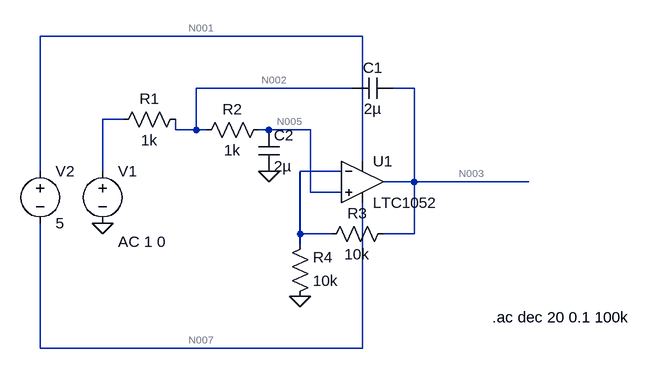
[diagram p0: schematic Draft4.asc]
Draft4.asc, the LTspice schematic file:
Version 4
SHEET 1 880 680
WIRE 240 -48 -256 -48
WIRE 224 32 -16 32
WIRE 320 32 288 32
WIRE -128 80 -160 80
WIRE -48 96 -48 80
WIRE -16 96 -16 32
WIRE -16 96 -48 96
WIRE 0 96 -16 96
WIRE 96 96 80 96
WIRE 160 96 96 96
WIRE 240 144 240 -48
WIRE -256 160 -256 -48
WIRE -160 160 -160 80
WIRE 208 160 144 160
WIRE 320 176 320 32
WIRE 320 176 272 176
WIRE 496 176 320 176
WIRE 160 192 160 96
WIRE 208 192 160 192
WIRE 144 256 144 160
WIRE 192 256 144 256
WIRE 320 256 320 176
WIRE 320 256 272 256
WIRE 144 272 144 256
WIRE -256 432 -256 240
WIRE 240 432 240 208
WIRE 240 432 -256 432
FLAG 96 160 0
FLAG -160 240 0
FLAG 144 352 0
SYMBOL Opamps\\LTC1052 240 112 R0
SYMATTR InstName U1
SYMBOL voltage -160 144 R0
WINDOW 123 24 124 Left 2
WINDOW 39 0 0 Left 2
SYMATTR InstName V1
SYMATTR Value ""
SYMATTR Value2 AC 1 0
SYMBOL voltage -256 144 R0
WINDOW 123 0 0 Left 2
WINDOW 39 0 0 Left 2
SYMATTR InstName V2
SYMATTR Value 5
SYMBOL res 96 80 R90
WINDOW 0 0 56 VBottom 2
WINDOW 3 32 56 VTop 2
SYMATTR InstName R2
SYMATTR Value 1k
SYMBOL cap 288 16 R90
WINDOW 0 0 32 VBottom 2
WINDOW 3 32 32 VTop 2
SYMATTR InstName C1
SYMATTR Value 2µ
SYMBOL res 288 240 R90
WINDOW 0 0 56 VBottom 2
WINDOW 3 32 56 VTop 2
SYMATTR InstName R3
SYMATTR Value 10k
SYMBOL res 128 368 M180
WINDOW 0 36 76 Left 2
WINDOW 3 36 40 Left 2
SYMATTR InstName R4
SYMATTR Value 10k
SYMBOL res -32 64 R90
WINDOW 0 0 56 VBottom 2
WINDOW 3 32 56 VTop 2
SYMATTR InstName R1
SYMATTR Value 1k
SYMBOL cap 80 96 R0
SYMATTR InstName C2
SYMATTR Value 2µ
TEXT 440 384 Left 2 !.ac dec 20 0.1 100k

The netlist it stands for:
* Draft4.asc
XU1 N005 N006 N001 N007 N003 LTC1052  ; pins In+ In- V+ V- OUT
V1 N004 0 AC 1 0
V2 N001 N007 5
R2 N005 N002 1k
C1 N003 N002 2µ
R3 N003 N006 10k
R4 0 N006 10k
R1 N002 N004 1k
C2 N005 0 2µ
.ac dec 20 0.1 100k
.backanno
.end

* Results of the author's LTspice run, read from the files saved beside the schematic
* Operating Point, zero values left out:
*   V(n001) = 2.514 V
*   V(n007) = -2.486 V
*   I(V2) = -1.473 mA
*   Ix(u1:3) = 1.473 mA
*   Ix(u1:4) = -1.473 mA
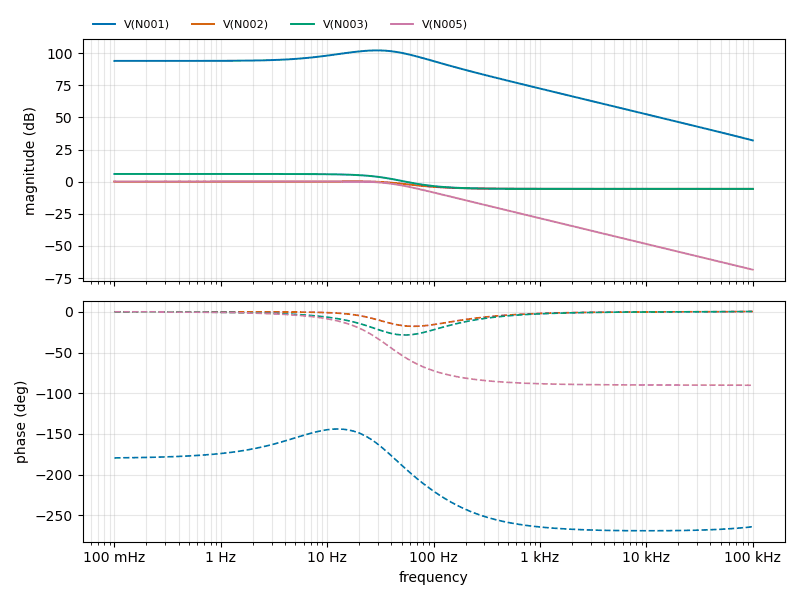
[diagram p1: AC Analysis of Draft4.asc, plotted from the saved traces]
* AC Analysis, 1 run:
*   V(N001): 93.97 dB at 100 mHz, 32.09 dB at 100 kHz, peak 102.14 dB at 28.18 Hz, 3 dB below the peak at 12.33 Hz and 57.49 Hz
*   V(N002): 0.00 dB at 100 mHz, -5.60 dB at 100 kHz, peak 0.20 dB at 17.78 Hz, 3 dB below the peak at 69.2 Hz
*   V(N003): 6.01 dB at 100 mHz, -5.60 dB at 100 kHz, peak 6.01 dB at 100 mHz, 3 dB below the peak at 34.8 Hz
*   V(N005): 0.00 dB at 100 mHz, -68.46 dB at 100 kHz, peak 0.13 dB at 15.85 Hz, 3 dB below the peak at 49.92 Hz